# Altium schematic sheet Bellerophon.SchDoc
size A4; SheetNumber: 3; SheetTotal: 3
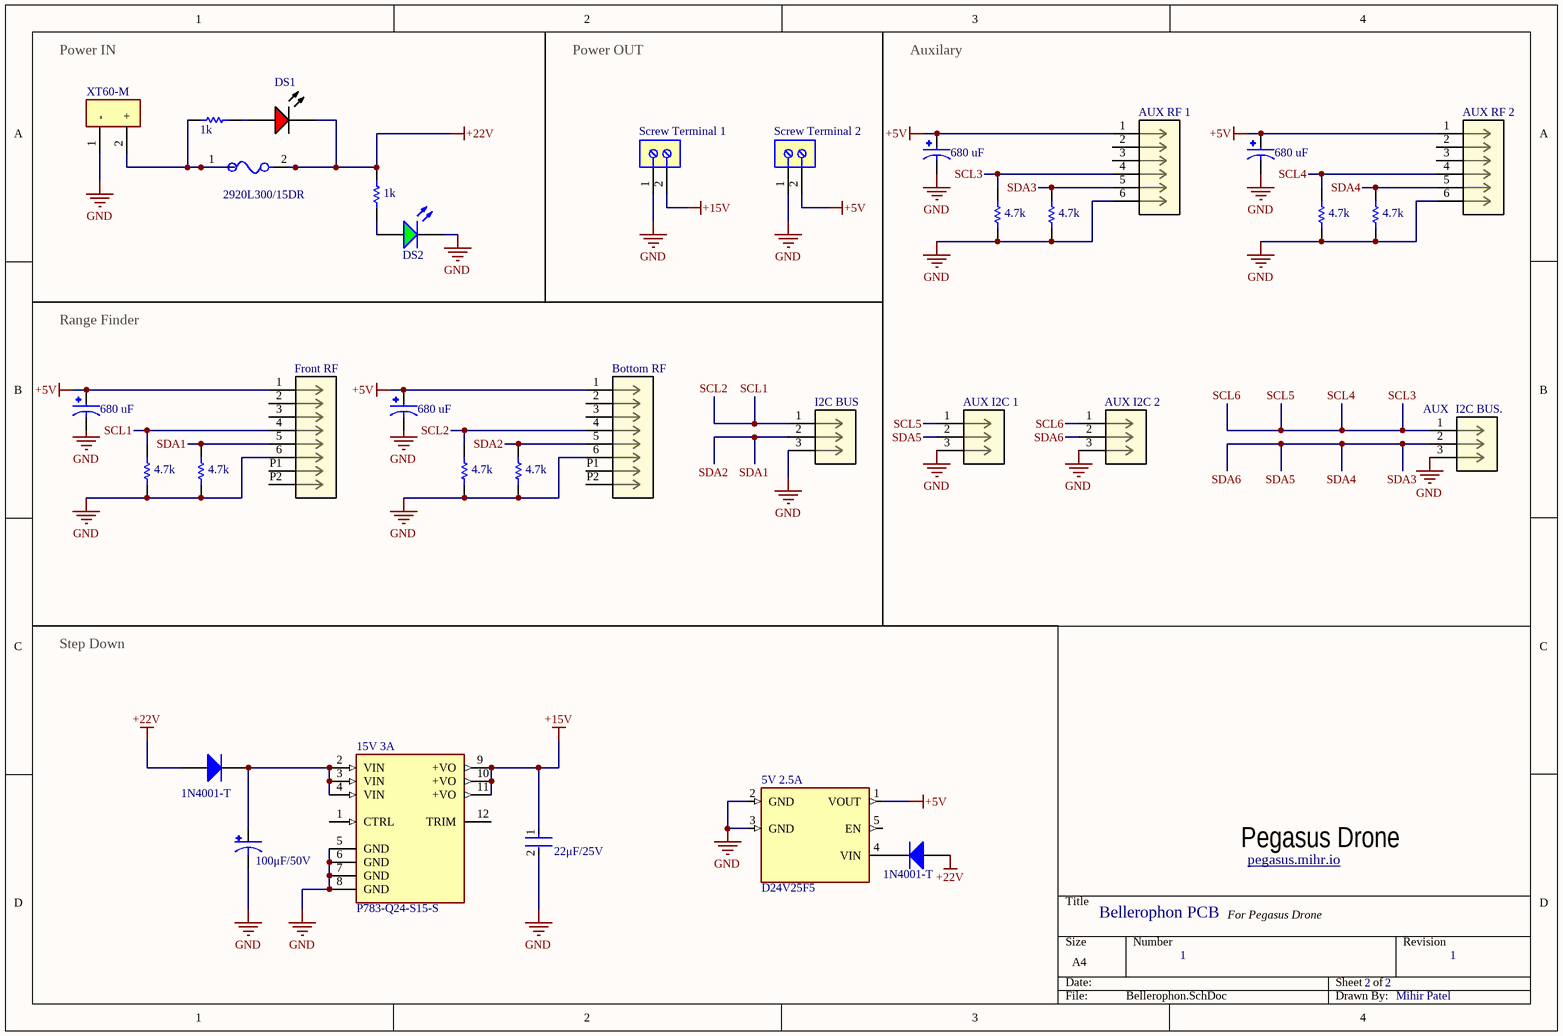
[diagram p0: Bellerophon.SchDoc]

## Parts
5V_2.5A  D24V25F5  [XDCR_12V_2.2A_STEP-DOWN_D24V22F12]
15V_3A  P783-Q24-S15-S  [CONV_P783-Q24-S15-S]
+5VDC  Screw Terminal 2  [PHOE-1725656-2]
+15VDC  Screw Terminal 1  [PHOE-1725656-2]
AUX_I2C_1  1053131303  [CON_1053131303]  (value not drawn)
AUX_I2C_2  1053131303  [CON_1053131303]  (value not drawn)
AUX_RF_1  1053131306  [CON_1053131306]  (value not drawn)
AUX_RF_2  1053131306  [CON_1053131306]  (value not drawn)
Bottom_RF  1053111306  [CON_1053111306_MOL]  (value not drawn)
C1  100μF/50V  [CAPAE830X1020N]
C2  22μF/25V  [FP-1210-L_3_3_0_4-W_2_5_0-MFG]
C3  680 uF  [CAP_EEEFN0J681V]
C4  680 uF  [CAP_EEEFN0J681V]
C5  680 uF  [CAP_EEEFN0J681V]
C6  680 uF  [CAP_EEEFN0J681V]
D1  1N4001-T  [DIOD-DO-41-P-2_V]
D2  1N4001-T  [DIOD-DO-41-P-2_V]
DS1  SML-LX1206IC-TR  [LUMX-SML-LX1206IC_V]  (value not drawn)
DS2  SML-LX1206GC-TR  [LUMX-SML-LX1206GC-TR_V]  (value not drawn)
F1  2920L300/15DR  [FP-2920L-MFG]
Front_RF  1053111306  [CON_1053111306_MOL]  (value not drawn)
I2C_BUS  1053091303  [CON_1053091303]  (value not drawn)
I2C_BUS.  1053131303  [CON_1053131303]  (value not drawn)
R1  1k  [RESC3225X70X50NL20T20]
R2  1k  [RESC3225X70X50NL20T20]
R3  4.7k  [RESC3225X70X50NL20T20]
R4  4.7k  [RESC3225X70X50NL20T20]
R5  4.7k  [RESC3225X70X50NL20T20]
R6  4.7k  [RESC3225X70X50NL20T20]
R7  4.7k  [RESC3225X70X50NL20T20]
R8  4.7k  [RESC3225X70X50NL20T20]
R9  4.7k  [RESC3225X70X50NL20T20]
R10  4.7k  [RESC3225X70X50NL20T20]
VIN  XT60-M  [AMASS_XT60-M]

## Blocks framed on the sheet
Power IN: DS1 DS2 F1 R1 R2 VIN
Power OUT: +5VDC +15VDC
Auxilary: AUX_I2C_1 AUX_I2C_2 AUX_RF_1 AUX_RF_2 C5 C6 I2C_BUS. R7-R10
Range Finder: Bottom_RF C3 C4 Front_RF I2C_BUS R3-R6
Step Down: 5V_2.5A 15V_3A C1 C2 D1 D2

## Nets
+5V: 5V_2.5A.1(VOUT) +5VDC.2 AUX_RF_1.1 AUX_RF_2.1 Bottom_RF.1 C3.1 C4.1 C5.1 C6.1 Front_RF.1
+15V: 15V_3A.9(+VO) 15V_3A.10(+VO) 15V_3A.11(+VO) +15VDC.2 C2.1
+22V: D1.1(A) D2.1(A) DS1.2(K) F1.2 R2.1
GND: 5V_2.5A.2(GND) 5V_2.5A.3(GND) 15V_3A.5(GND) 15V_3A.6(GND) 15V_3A.7(GND) 15V_3A.8(GND) +5VDC.1 +15VDC.1 AUX_I2C_1.3 AUX_I2C_2.3 AUX_RF_1.6 AUX_RF_2.6 Bottom_RF.6 C1.2(NEG) C2.2 C5.2 C6.2 DS2.2(K) Front_RF.6 I2C_BUS.3 I2C_BUS..3 R3.2 R4.2 R5.2 R6.2 R7.2 R8.2 R9.2 R10.2 VIN.1(-)
SCL1: Bottom_RF.4 Front_RF.4 I2C_BUS.1 R4.1 R6.1  [also labelled SCL2]
SCL3: AUX_I2C_1.1 AUX_I2C_2.1 AUX_RF_1.4 AUX_RF_2.4 I2C_BUS..1 R8.1 R10.1  [also labelled SCL4, SCL5, SCL6]
SDA1: Bottom_RF.5 Front_RF.5 I2C_BUS.2 R3.1 R5.1  [also labelled SDA2]
SDA3: AUX_I2C_1.2 AUX_I2C_2.2 AUX_RF_1.5 AUX_RF_2.5 I2C_BUS..2 R7.1 R9.1  [also labelled SDA4, SDA5, SDA6]
Net5V_2.5A_4: 5V_2.5A.4(VIN) D2.2(K)
Net15V_3A_2: 15V_3A.2(VIN) 15V_3A.3(VIN) 15V_3A.4(VIN) C1.1(POS) D1.2(K)
NetDS1_1: DS1.1(A) R1.2
NetDS2_1: DS2.1(A) R2.2
NetF1_1: F1.1 R1.1 VIN.2(+)

Not connected (* = marked no-connect by the designer): 5V_2.5A 5(EN) 6(GND); 15V_3A 1(CTRL) 12(TRIM); AUX_RF_1 2 3; AUX_RF_2 2 3; Bottom_RF 2 3 P1 P2; C3 2; C4 2; Front_RF 2 3 P1 P2

## Notes on the sheet
- (near I2C_BUS.) AUX
- Pegasus Drone
- Bellerophon PCB
- For Pegasus Drone
- pegasus.mihr.io <http://pegasus.mihr.io>
- 1
- 2
- Mihir Patel
- Labels drawn without touching a wire or pin: GND

## Library data of the parts
5V_2.5A = 12V_2.2A_STEP-DOWN_D24V22F12: Converter: step down; Uin: 12.7Ã·36V; Uout: 12V; 2200mA; 90Ã·95%; MP: 12V 2.2A STEP-DOWN D24V22F12; MF: Pololu; Price: None; Availability: Unavailable; SnapEDA_Link: https://www.snapeda.com/parts/12V%202.2A%20STEP-DOWN%20D24V22F12/Pololu/view-part/1771637/?ref=snap; Value: *; Package: None
+5VDC +15VDC = CMP-2000-05299-1: Male Header, Pitch 2.54 mm, 1 x 2 Position, Height 9 mm, Tail Length 3.5 mm; Manufacturer part No.: 1725656; Manufacturer: Phoenix Contact; Number of contacts: 2; Content: 250pc(s); Pitch: 2.54mm; Industrial packaging: Yes; Colour: Green; Type: MPT0,5/2-2,54; Datasheet URL: http://datasheet.octopart.com/1725656-Phoenix-Contact-datasheet-5302866.pdf; Manufacturer URL: http://www.phoenixcontact.com/; Datasheet Version: Apr-08
AUX_I2C_1 AUX_I2C_2 I2C_BUS. = 1053131303: No Description Available; Mfr_Name: Molex Connector Corporation; Copyright: Copyright (C) 2022 Ultra Librarian. All rights reserved.; Manufacturer_Part_Number: 1053131303; Digi-Key_Part_Number_1: WM15142-ND; RefDes: RefDes; Type: DEV
AUX_RF_1 AUX_RF_2 = 1053131306: No Description Available; Mfr_Name: Molex Connector Corporation; Copyright: Copyright (C) 2022 Ultra Librarian. All rights reserved.; Manufacturer_Part_Number: 1053131306; Digi-Key_Part_Number_1: WM15145-ND; RefDes: RefDes; Type: DEV
Bottom_RF Front_RF = 1053111306: No Description Available; Mfr_Name: Molex Connector Corporation; Copyright: Copyright (C) 2022 Ultra Librarian. All rights reserved.; Manufacturer_Part_Number: 1053111306; Digi-Key_Part_Number_1: WM15093-ND; RefDes: RefDes; Type: DEV
C1 = EDK107M050A9MAA: 100ÂµF 50V Aluminum Electrolytic Capacitors Radial, Can - SMD 2000 Hrs @ 85Â°C; MF: KEMET; Value: *; SnapEDA_Link: https://www.snapeda.com/parts/EDK107M050A9MAA/KEMET/view-part/285947/?ref=snap; Price: None; Availability: Unavailable; Package: Radial Kemet; MP: EDK107M050A9MAA
C2 = CMP-2000-05483-2: General Purpose Ceramic Capacitor, 1210, 22uF, 10%, X5R, 15%, 16V; Tolerance: 10%; Width: 0.098inch; Length: 3.2mm; Min Operating Temperature: -55°C; Capacitance: 22uF; Case/Package: 1210; Termination: SMD/SMT; Voltage: 16V; Number of Pins: 2; Thickness: 0.11inch; Height: 2.79mm; Weight: 0.000564oz; Case Code (Imperial): 1210; Contact Plating: Tin; Lead Free: Lead Free; RoHS Compliant: Yes; Packaging: Tape and Reel; Package Quantity: 1; Construction: Flat; Series: -; REACH SVHC: No SVHC; Case Code (Metric): 3225; Size: 2.79mm; Radiation Hardening: No; Voltage Rating: 16V; Depth: 2.5mm; Mount: Surface Mount; Voltage Rating (DC): 16V; Dielectric: X5R; Max Operating Temperature: 85°C
C3-C6 = EEEFN0J681V: CAP ALUM 680UF 20% 6.3V SMD; MF: Panasonic; MP: EEEFN0J681V; Check_prices: https://www.snapeda.com/parts/EEEFN0J681V/Panasonic/view-part/?ref=eda; Package: RADIAL-2 Panasonic; SnapEDA_Link: https://www.snapeda.com/parts/EEEFN0J681V/Panasonic/view-part/?ref=snap; Value: *; Price: None; Purchase-URL: https://pricing.snapeda.com/search/part/EEEFN0J681V/?ref=eda; Availability: In Stock
D1 D2 = CMP-0639-00006-2: 1.0 A Rectifier, 15 pF, 50 V, -65 to 150 degC, 2-Pin DO-41 Plastic, RoHS, Tape and Reel; Manufacturer: Diodes Inc; VF (V): 1; CT (pF): 15; Max. IR (uA): 5; VRRM (V): 50; Max. IFSM (A): 30; RoHS: TRUE; Mounting Technology: Through Hole; PartNumber: 1N4001-T; ComponentLink2Description: Datasheet; DatasheetVersion: Rev. 8-2; Operating Temperature Range (degC): -65 to 150; Packing: Tape and Reel; PackageReference: DO-41-P-2; ComponentLink1URL: http://diodes.com/; PackageDescription: 2-Pin Axial Lead, Body 4.635 x 2.36 mm, Lead Spread 25.4 mm; ComponentLink2URL: http://diodes.com/datasheets/ds28002.pdf; Max. Average Rectified Current IO (A): 1; ComponentLink1Description: Manufacturer URL
DS1 = CMP-2000-07123-1: LED Red, 65 mW, -40 to 85 degC, 2-Pin SMD, RoHS, Tape and Reel; Manufacturer: Lumex; LED Material: GaAsP; Peak Wavelength: 635nm; Number of LEDs: 1; Viewing Angle: 160; Reverse Voltage: 5(Min)V; Lens Appearance: ColorlessNonDiffused; Intensity: 6mcd; Type: Uni-Color; Pin_Count: 2; Lens Dimensions: 2x1.6x0.5mm; Mounting: SurfaceMount; ECCN: EAR99; RoHS: Unknown; Package Description: 2-Pin Surface Mount Device, Body 3.2 x 1.5 mm; Mounting Technology: SurfaceMount; Dominant Wavelength: N/A; Supplier_Package: SMD; Supplier Standard Pack: 3,000; Color: Red; Dimension: 3.2x1.6x1.1mm; HTS: 8541402000; Part No: SML-LX1206IC-TR; Family: SML-LX1206IC; Supplier: Lumex; Datasheet URL: http://www.lumex.com/content/files/ProductAttachment/SML-LX1206IC-TR.pdf; Package Reference: SML-LX1206IC; Manufacturer URL: http://www.lumexinstruments.com/; Operating Temperature: -25to85C; Packaging: TapeandReel; Datasheet Version: Rev. J, 08/2012
DS2 = CMP-2000-07122-1: Green Led, Water Clear Lens, 10 mcd, 565 nm, 2.2 V, -40 to 85 degC, 2-Pin SMD, RoHS, Tape and Reel; Manufacturer: Lumex; Number of LEDs: 1; Type: Uni-Color; Viewing Angle: 160; Pin_Count: 2; Intensity: 10mcd; Reverse Voltage: 5(Min)V; COO: CN; LED Material: GaP; Peak Wavelength: 565nm; Lens Appearance: ColorlessNonDiffused; Datasheet Version: Rev. J, 04/2011; Package Description: 2-Pin Surface Mount Device, Body 3.2 x 1.6 mm; Part No: SML-LX1206GC-TR; Lens Dimensions: 2x1.6x0.5mm; Dimension: 3.2x1.6x1.1mm; Color: Green; Supplier: Lumex; Supplier Standard Pack: 3,000; Manufacturer URL: http://www.lumexinstruments.com/; Dominant Wavelength: N/A; ECCN: EAR99; Datasheet URL: http://www.mouser.com/ds/2/244/SML-LX1206GC-TR-112732.pdf; HTS: 8541402000; Mounting: SurfaceMount; Package Reference: SML-LX1206GC-TR; Family: SML-LX1206GC; Packaging: TapeandReel; RoHS: Yes; Operating Temperature: -40to85C; Supplier_Package: SMD; Mounting Technology: SurfaceMount
F1 = CMP-2000-05550-2: PTC RESET FUSE 15V 3A 2920; Manufacturer: Littelfuse; Current Rating: 40A; Trip Current: 5A; Trip Time: 20s; Resistance: 0.015-0.048Ω; Value: 0.015-0.048Ω; Device Class L3: unset; Temperature: -40°C to +85°C; ComponentLink2Description: Datasheet; Temperature Range High: +85°C; Digikey Description: PTC RESET FUSE 15V 3A 2920; Lead Free: Yes; Height: 1.25mm; Voltage Rating: 15V; Package: 2920L; Temperature Range Low: -40°C; Ambient Temperature Range High: +85°C; RoHS: TRUE; Ambient Temperature Range Low: -40°C; Device Class L2: PTC Resettable Fuses; Category: Fuse; Automotive: No; ComponentLink2URL: https://m.littelfuse.com/~/media/electronics/datasheets/resettable_ptcs/littelfuse_ptc_2920l_datasheet.pdf.pdf; Device Class L1: Circuit Protection; Hold Current: 3A; Manufacturer Part Number: 2920L300/15DR; Octopart: https://octopart.com/2920l300%2F15dr-littelfuse-673797
I2C_BUS = 1053091303: No Description Available; Mfr_Name: Molex Connector Corporation; Copyright: Copyright (C) 2022 Ultra Librarian. All rights reserved.; Manufacturer_Part_Number: 1053091303; Digi-Key_Part_Number_1: WM15037-ND; RefDes: RefDes; Type: DEV
R1-R10 = CMP-2005-03583-1: Part Number: ERJ-14YJ472U; Manufacturer: Panasonic
VIN = XT60-M: Plug; DC supply; XT60; male; PIN: 2; for cable; soldered; 30A; 500V; MF: AMASS; MP: XT60-M; Price: None; Package: Package Analog Devices; Value: *; Availability: Unavailable; SnapEDA_Link: https://www.snapeda.com/parts/XT60-M/AMASS/view-part/2883912/?ref=snap
15V_3A = P783-Q24-S15-S: Package: None; Price: None; Value: *; MP: P783-Q24-S15-S; Availability: Unavailable